# Altium schematic sheet MainPower.SchDoc: Main Power of Power Bar
size A4; Author: Staok
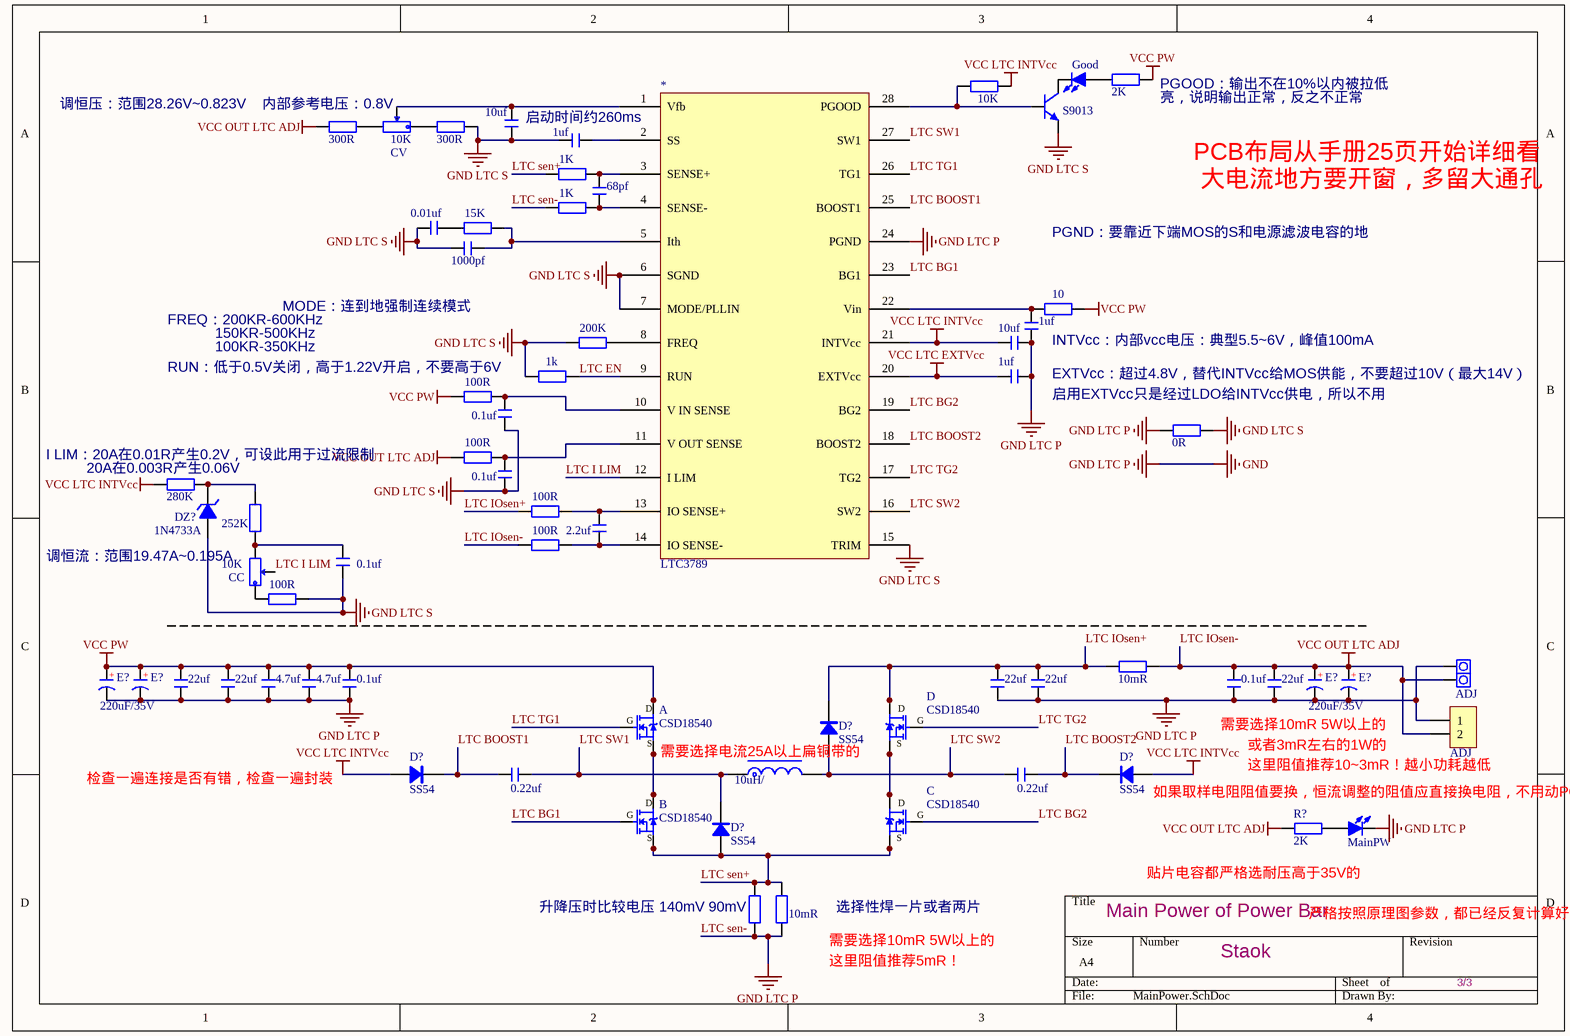
[diagram p0: MainPower.SchDoc]

## Parts
(Parts that share a designator on the sheet are numbered #1, #2 ... from top to bottom, then left to right.)
*  LTC3789  [SSOP28_N]
A  CSD18540  [Q5B]
B  CSD18540  [Q5B]
C  CSD18540  [Q5B]
C?#1  10uf  [C 0805_L]
C?#2  1uf  [C 0805_L]
C?#3  68pf  [C 0805_L]
C?#4  0.01uf  [C 0805_L]
C?#5  1000pf  [C 0805_L]
C?#6  1uf  [C 0805_L]
C?#7  10uf  [C 0805_L]
C?#8  1uf  [C 0805_L]
C?#9  0.1uf  [C 0805_L]
C?#10  0.1uf  [C 0805_L]
C?#11  2.2uf  [C 0805_L]
C?#12  0.1uf  [C 0805_L]
C?#13  22uf  [C 0805_L]
C?#14  22uf  [C 0805_L]
C?#15  22uf  [C 0805_L]
C?#16  4.7uf  [C 0805_L]
C?#17  4.7uf  [C 0805_L]
C?#18  0.1uf  [C 0805_L]
C?#19  22uf  [C 0805_L]
C?#20  0.1uf  [C 0805_L]
C?#21  22uf  [C 0805_L]
C?#22  0.22uf  [C 0805_L]
C?#23  0.22uf  [C 0805_L]
CC  10K  [RV097-1-G15]
CV  10K  [RV097-1-G15]
D  CSD18540  [Q5B]
D?#1  SS54  [SMA]
D?#2  SS54  [SMA]
D?#3  SS54  [SMA]
D?#4  SS54  [SMA]
DZ?  1N4733A  [DO-41GV]
E?#1  220uF/35V  [CS 3.5*8*11.5 - R]
E?#2  220uF/35V  [CS 3.5*8*11.5 - R]  (value not drawn)
E?#3  220uF/35V  [CS 3.5*8*11.5 - R]
E?#4  220uF/35V  [CS 3.5*8*11.5 - R]  (value not drawn)
H?  ADJ  [T Head]
JP?  ADJ  [KF128-5.08-2P]
L?  10uH/  [L-SMD-0630]
LED?#1  Good  [LED 0805B]
LED?#2  MainPW  [LED 0805B]
Q?  S9013  [SOT23-3L]
R?#1  2K  [R 0805_L]
R?#2  10K  [R 0805_L]
R?#3  300R  [R 0805_L]
R?#4  300R  [R 0805_L]
R?#5  1K  [R 0805_L]
R?#6  1K  [R 0805_L]
R?#7  15K  [R 0805_L]
R?#8  10  [R 0805_L]
R?#9  200K  [R 0805_L]
R?#10  1k  [R 0805_L]
R?#11  100R  [R 0805_L]
R?#12  0R  [R 0805_L]
R?#13  100R  [R 0805_L]
R?#14  280K  [R 0805_L]
R?#15  252K  [R 0805_L]
R?#16  100R  [R 0805_L]
R?#17  100R  [R 0805_L]
R?#18  100R  [R 0805_L]
R?#19  10mR  [R 2512-HP_M]
R?#20  2K  [R 0805_L]
R?#21  10mR  [R 2512-HP_M]  (value not drawn)
R?#22  10mR  [R 2512-HP_M]

## Nets
GND LTC S: *.6(SGND) *.7(MODE/PLLIN) *.15(TRIM) C?#1.1 C?#2.2 C?#4.2 C?#5.2 C?#9.2 C?#10.2 C?#12.2 DZ?.1(A) Q?.2(E) R?#4.1 R?#9.1 R?#10.2 R?#12.2 R?#18.1
LTC IOsen-: C?#20.2 C?#21.2 E?#3.1(A) E?#4.1(A) H?.2 JP?.2 R?#3.1 R?#13.1 R?#17.1 R?#19.1 R?#20.2  [also labelled VCC OUT LTC ADJ]
LTC sen-: *.24(PGND) C?#6.2 C?#7.2 C?#8.2 C?#13.2 C?#14.2 C?#15.1 C?#16.1 C?#17.1 C?#18.1 C?#19.1 C?#20.1 C?#21.1 E?#1.2(K) E?#2.2(K) E?#3.2(K) E?#4.2(K) H?.1 JP?.1 LED?#2.2(K) R?#6.1 R?#12.1 R?#21.1 R?#22.1  [also labelled GND, GND LTC P]
VCC LTC EXTVcc: *.20(EXTVcc) C?#8.1
VCC LTC INTVcc: *.21(INTVcc) C?#7.1 D?#2.1(A) D?#3.1(A) R?#2.2 R?#14.2
VCC PW: A.5(D) A.6(D) A.7(D) A.8(D) C?#13.1 C?#15.2 C?#16.2 C?#17.2 C?#18.2 E?#1.1(A) E?#2.1(A) R?#1.1 R?#8.2 R?#11.1
LTC BG1: *.23(BG1) B.4(G)
LTC BG2: *.19(BG2) C.4(G)
LTC BOOST1: *.25(BOOST1) C?#22.2 D?#2.2(K)
LTC BOOST2: *.18(BOOST2) C?#23.1 D?#3.2(K)
LTC EN: *.9(RUN) R?#10.1
LTC I LIM: *.12(I_LIM) CC.2
LTC IOsen+: C?#14.1 C?#19.2 D.5(D) D.6(D) D.7(D) D.8(D) D?#1.2(K) R?#16.1 R?#19.2
LTC sen+: B.1(S) B.2(S) B.3(S) C.1(S) C.2(S) C.3(S) D?#4.1(A) R?#5.1 R?#21.2 R?#22.2
LTC SW1: *.27(SW1) C?#22.1 D?#4.2(K) L?.1
LTC SW2: *.16(SW2) C?#23.2 D?#1.1(A) L?.2
LTC TG1: *.26(TG1) A.4(G)
LTC TG2: *.17(TG2) D.4(G)
Net*_1: *.1(Vfb) C?#1.2 CV.2
Net*_2: *.2(SS) C?#2.1
Net*_3: *.3(SENSE+) C?#3.1 R?#5.2
Net*_4: *.4(SENSE-) C?#3.2 R?#6.2
Net*_5: *.5(Ith) C?#5.1 R?#7.2
Net*_8: *.8(FREQ) R?#9.2
Net*_10: *.10(V_IN_SENSE) C?#9.1 R?#11.2
Net*_11: *.11(V_OUT_SENSE) C?#10.1 R?#13.2
Net*_13: *.13(IO_SENSE+) C?#11.1 R?#16.2
Net*_14: *.14(IO_SENSE-) C?#11.2 R?#17.2
Net*_22: *.22(Vin) C?#6.1 R?#8.1
Net*_28: *.28(PGOOD) Q?.1(B) R?#2.1
NetA_1: A.1(S) A.2(S) A.3(S) B.5(D) B.6(D) B.7(D) B.8(D)
NetC?#4_1: C?#4.1 R?#7.1
NetC?#12_1: C?#12.1 CC.3 R?#15.2
NetC_5: C.5(D) C.6(D) C.7(D) C.8(D) D.1(S) D.2(S) D.3(S)
NetCC_1: CC.1 R?#18.2
NetCV_1: CV.1 R?#4.2
NetCV_3: CV.3 R?#3.2
NetDZ?_2: DZ?.2(K) R?#14.1 R?#15.1
NetLED?#1_1: LED?#1.1(A) R?#1.2
NetLED?#1_2: LED?#1.2(K) Q?.3(C)
NetLED?#2_1: LED?#2.1(A) R?#20.1

## Notes on the sheet
- 调恒压：范围28.26V~0.823V
- (near R?#3) 内部参考电压：0.8V
- (near R?#1) PGOOD：输出不在10%以内被拉低
- (near R?#1) 亮，说明输出正常，反之不正常
- (near C?#1) 启动时间约260ms
- PCB布局从手册25页开始详细看
- PGND：要靠近下端MOS的S和电源滤波电容的地
- 大电流地方要开窗，多留大通孔
- MODE：连到地强制连续模式
- RUN：低于0.5V关闭，高于1.22V开启，不要高于6V
- FREQ：200KR-600KHz
- 150KR-500KHz
- 100KR-350KHz
- INTVcc：内部vcc电压：典型5.5~6V，峰值100mA
- (near C?#8) EXTVcc：超过4.8V，替代INTVcc给MOS供能，不要超过10V（最大14V）
- 启用EXTVcc只是经过LDO给INTVcc供电，所以不用
- (near R?#14) I LIM：20A在0.01R产生0.2V，可设此用于过流限制
- (near R?#14) 20A在0.003R产生0.06V
- (near DZ?) 调恒流：范围19.47A~0.195A
- 检查一遍连接是否有错，检查一遍封装
- 需要选择电流25A以上扁铜带的
- (near C?#21) 需要选择10mR 5W以上的
- 或者3mR左右的1W的
- 这里阻值推荐10~3mR！越小功耗越低
- 如果取样电阻阻值要换，恒流调整的阻值应直接换电阻，不用动PCB
- 升降压时比较电压 140mV 90mV
- 选择性焊一片或者两片
- (near R?#20) 贴片电容都严格选耐压高于35V的
- 严格按照原理图参数，都已经反复计算好
- (near R?#22) 需要选择10mR 5W以上的
- 这里阻值推荐5mR！
- 3/3
- (in symbol C-CS) +

## Library data of the parts
C?#1-C?#23 = C: 无极性贴片电容; 版权归属: 源创客; 材质: X7R; BOM名称: 无极性贴片电容; 学习资源: www.ooocke.com
CC CV = RP-ID: 插件单联电位器; BOM名称: 插件电位器; 版权归属: 源创客; 学习资源: www.ooocke.com
D?#1-D?#4 = SS54: 肖特基二极管; 版权归属: 源创客; 属性: 40V/3A; BOM名称: 肖特基二极管; 学习资源: www.ooocke.com
DZ? = 1N4620: 3.3V/0.5W稳压管; 版权归属: 源创客; BOM名称: 3.3V/0.5W稳压管; 学习资源: www.ooocke.com
E?#1-E?#4 = C-CS: 直插固态电容; 版权归属: 源创客; BOM名称: 直插固态电容; 学习资源: www.ooocke.com
H? = PAD2: 引线焊盘; 版权归属: 源创客; BOM名称: 引线焊盘; 学习资源: www.ooocke.com
JP? = Header 2: 2P接插件; 版权归属: 源创客; BOM名称: 2P接插件; 学习资源: www.ooocke.com
L? = L-CD: 贴片功率电感; BOM名称: 功率电感; 版权归属: 源创客; 学习资源: www.ooocke.com
LED?#1 LED?#2 = LED-SMD: 贴片LED; 版权归属: 源创客; BOM名称: 贴片LED; 学习资源: www.ooocke.com
Q? = 9013-SMD: 低频放大-NPN型; 版权归属: 源创客; 属性: 50V?0.5A?0.625W; BOM名称: 低频放大-NPN型; 学习资源: www.ooocke.com
R?#1-R?#18 R?#20 = R: 贴片电阻; 版权归属: 源创客; BOM名称: 贴片电阻; 学习资源: www.ooocke.com
R?#19 R?#21 R?#22 = R-Precision: 精密贴片电阻; BOM名称: 精密电阻; 版权归属: 源创客; 学习资源: www.ooocke.com